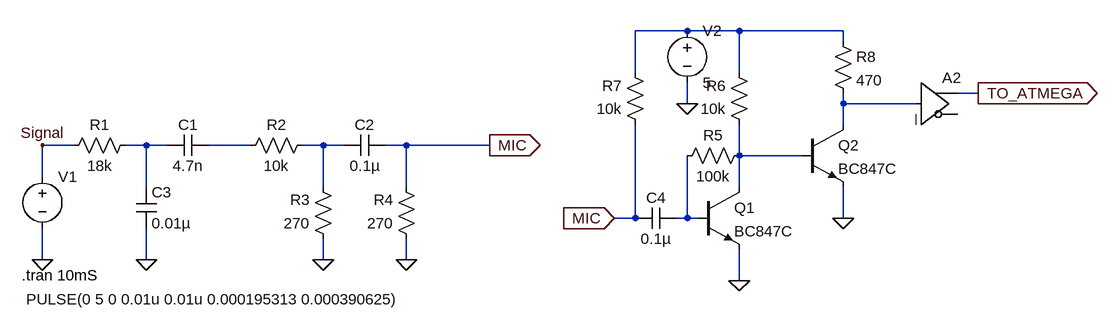
[diagram p0: schematic mic-in_simulation_2.asc]
mic-in_simulation_2.asc, the LTspice schematic file:
Version 4
SHEET 1 2012 680
WIRE 992 -288 912 -288
WIRE 1072 -288 992 -288
WIRE 1232 -288 1072 -288
WIRE 1232 -272 1232 -288
WIRE 912 -224 912 -288
WIRE 1072 -224 1072 -288
WIRE 1440 -192 1408 -192
WIRE 992 -176 992 -208
WIRE 1232 -176 1232 -192
WIRE 1344 -176 1232 -176
WIRE 1232 -144 1232 -176
WIRE 48 -112 0 -112
WIRE 160 -112 128 -112
WIRE 192 -112 160 -112
WIRE 320 -112 256 -112
WIRE 432 -112 400 -112
WIRE 464 -112 432 -112
WIRE 560 -112 528 -112
WIRE 688 -112 560 -112
WIRE 1072 -96 1072 -144
WIRE 1168 -96 1072 -96
WIRE 0 -64 0 -112
WIRE 160 -48 160 -112
WIRE 432 -48 432 -112
WIRE 560 -48 560 -112
WIRE 1072 -48 1072 -96
WIRE 912 0 912 -144
WIRE 912 0 880 0
WIRE 992 0 992 -96
WIRE 992 0 976 0
WIRE 1008 0 992 0
WIRE 1232 0 1232 -48
WIRE 0 64 0 16
WIRE 160 64 160 16
WIRE 432 64 432 32
WIRE 560 64 560 32
WIRE 1072 96 1072 48
FLAG 0 64 0
FLAG 432 64 0
FLAG 560 64 0
FLAG 160 64 0
FLAG 688 -112 MIC
IOPIN 688 -112 Out
FLAG 880 0 MIC
IOPIN 880 0 In
FLAG 1072 96 0
FLAG 992 -176 0
FLAG 1232 0 0
FLAG 1440 -192 TO_ATMEGA
IOPIN 1440 -192 Out
FLAG 0 -112 Signal
SYMBOL voltage 0 -80 R0
WINDOW 123 0 0 Left 2
WINDOW 39 0 0 Left 2
WINDOW 3 -25 205 Left 2
SYMATTR Value PULSE(0 5 0 0.01u 0.01u 0.000195313 0.000390625)
SYMATTR InstName V1
SYMBOL res 144 -128 R90
WINDOW 0 0 56 VBottom 2
WINDOW 3 32 56 VTop 2
SYMATTR InstName R1
SYMATTR Value 18k
SYMBOL res 416 -128 R90
WINDOW 0 0 56 VBottom 2
WINDOW 3 32 56 VTop 2
SYMATTR InstName R2
SYMATTR Value 10k
SYMBOL res 448 48 R180
WINDOW 0 36 76 Left 2
WINDOW 3 36 40 Left 2
SYMATTR InstName R3
SYMATTR Value 270
SYMBOL res 576 48 R180
WINDOW 0 36 76 Left 2
WINDOW 3 36 40 Left 2
SYMATTR InstName R4
SYMATTR Value 270
SYMBOL cap 256 -128 R90
WINDOW 0 0 32 VBottom 2
WINDOW 3 32 32 VTop 2
SYMATTR InstName C1
SYMATTR Value 4.7n
SYMBOL cap 528 -128 R90
WINDOW 0 0 32 VBottom 2
WINDOW 3 32 32 VTop 2
SYMATTR InstName C2
SYMATTR Value 0.1µ
SYMBOL cap 144 -48 R0
SYMATTR InstName C3
SYMATTR Value 0.01µ
SYMBOL cap 976 -16 R90
WINDOW 0 0 32 VBottom 2
WINDOW 3 32 32 VTop 2
SYMATTR InstName C4
SYMATTR Value 0.1µ
SYMBOL res 1088 -112 R90
WINDOW 0 0 56 VBottom 2
WINDOW 3 32 56 VTop 2
SYMATTR InstName R5
SYMATTR Value 100k
SYMBOL res 1088 -128 R180
WINDOW 0 36 76 Left 2
WINDOW 3 36 40 Left 2
SYMATTR InstName R6
SYMATTR Value 10k
SYMBOL res 928 -128 R180
WINDOW 0 36 76 Left 2
WINDOW 3 36 40 Left 2
SYMATTR InstName R7
SYMATTR Value 10k
SYMBOL npn 1008 -48 R0
SYMATTR InstName Q1
SYMATTR Value BC847C
SYMBOL voltage 992 -304 R0
WINDOW 123 0 0 Left 2
WINDOW 39 0 0 Left 2
SYMATTR InstName V2
SYMATTR Value 5
SYMBOL npn 1168 -144 R0
SYMATTR InstName Q2
SYMATTR Value BC847C
SYMBOL res 1216 -288 R0
SYMATTR InstName R8
SYMATTR Value 470
SYMBOL Digital\\buf 1344 -240 R0
SYMATTR InstName A2
SYMATTR Value2 Vhigh=5 Vlow=0 Ref=1.5
TEXT -32 88 Left 2 !.tran 10mS

The netlist it stands for:
* mic-in_simulation_2.asc
V1 Signal 0 PULSE(0 5 0 0.01u 0.01u 0.000195313 0.000390625)
R1 N003 Signal 18k
R2 N005 N004 10k
R3 0 N005 270
R4 0 MIC 270
C1 N004 N003 4.7n
C2 MIC N005 0.1µ
C3 N003 0 0.01µ
C4 N007 MIC 0.1µ
R5 N006 N007 100k
R6 N006 N001 10k
R7 MIC N001 10k
Q1 N006 N007 0 0 BC847C
V2 N001 0 5
Q2 N002 N006 0 0 BC847C
R8 N001 N002 470
A2 N002 0 0 0 0 0 TO_ATMEGA 0 BUF Vhigh=5 Vlow=0 Ref=1.5
.model NPN NPN
.model PNP PNP
.lib standard.bjt
.tran 10mS
.backanno
.end